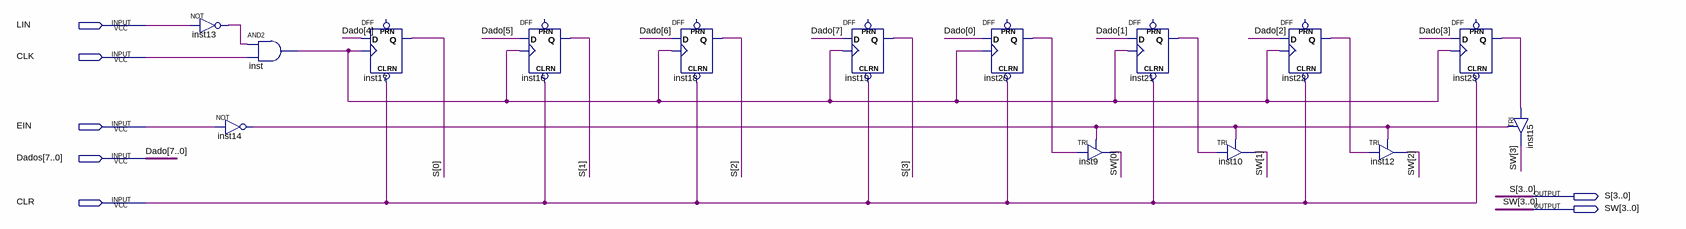
[diagram p0: schematic sheet]
// Quartus schematic RegistradorInstrucoes.bdf as structural Verilog: 15 symbols, 7 pins
module RegistradorInstrucoes (
  input  LIN,
  input  CLK,
  input  EIN,
  input  [7:0] Dados,
  input  CLR,
  output [3:0] S,
  output [3:0] SW
);

  wire inst13_out, inst14_out, inst20_q, inst21_q, inst22_q, inst23_q, inst_out;

  not inst13 (inst13_out, LIN);
  and inst (inst_out, inst13_out, CLK);
  not inst14 (inst14_out, EIN);
  DFF inst17 (.CLRN(CLR), .CLK(inst_out), .D(Dados[4]), .Q(S[0]));  // open: PRN
  DFF inst16 (.CLRN(CLR), .CLK(inst_out), .D(Dados[5]), .Q(S[1]));  // open: PRN
  DFF inst18 (.CLRN(CLR), .CLK(inst_out), .D(Dados[6]), .Q(S[2]));  // open: PRN
  DFF inst19 (.CLRN(CLR), .CLK(inst_out), .D(Dados[7]), .Q(S[3]));  // open: PRN
  DFF inst20 (.CLRN(CLR), .CLK(inst_out), .D(Dados[0]), .Q(inst20_q));  // open: PRN
  TRI inst9 (.IN(inst20_q), .OE(inst14_out), .OUT(SW[0]));
  DFF inst21 (.CLRN(CLR), .CLK(inst_out), .D(Dados[1]), .Q(inst21_q));  // open: PRN
  TRI inst10 (.IN(inst21_q), .OE(inst14_out), .OUT(SW[1]));
  DFF inst22 (.CLRN(CLR), .CLK(inst_out), .D(Dados[2]), .Q(inst22_q));  // open: PRN
  TRI inst12 (.IN(inst22_q), .OE(inst14_out), .OUT(SW[2]));
  DFF inst23 (.CLRN(CLR), .CLK(inst_out), .D(Dados[3]), .Q(inst23_q));  // open: PRN
  TRI inst15 (.IN(inst23_q), .OE(inst14_out), .OUT(SW[3]));

  // Other names for the same wires on the sheet: Dado[7:0] = Dados
endmodule
